# Altium schematic sheet CCD.SchDoc
size A4; SheetNumber: 4; SheetTotal: 5
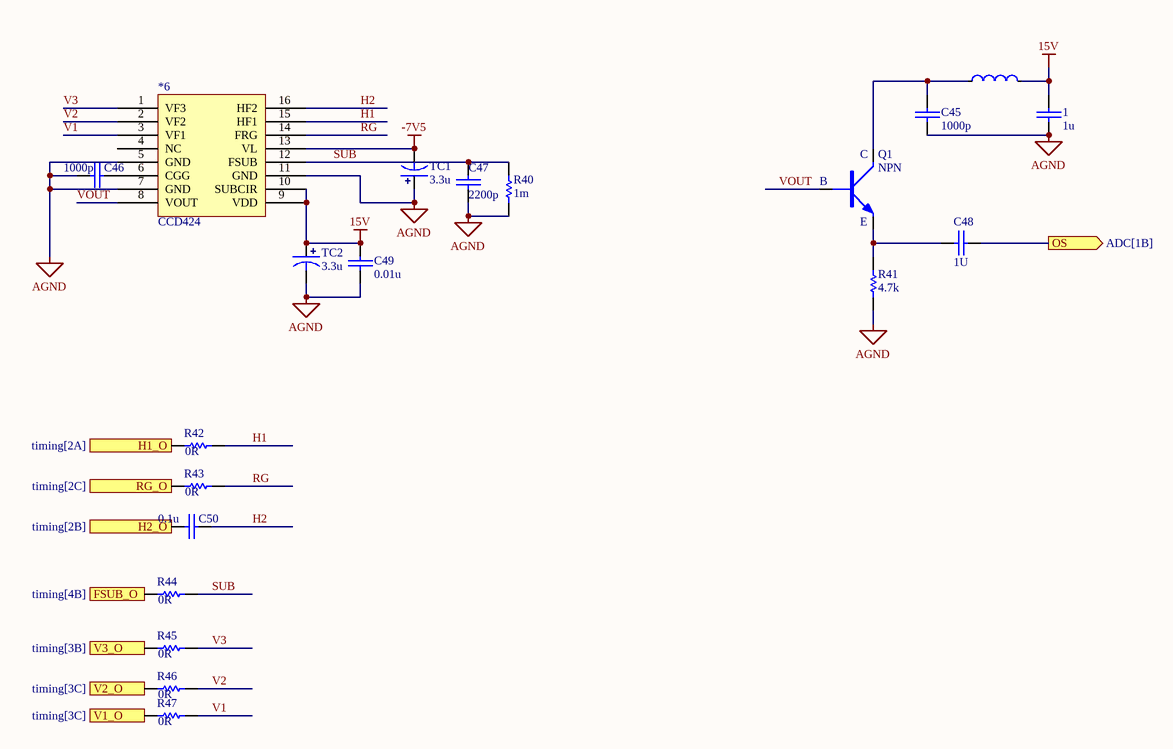
[diagram p0: CCD.SchDoc]

## Parts
1  1u  [0603C]
*6  CCD424  [CCD424]
C45  1000p  [0603C]
C46  1000p  [0603C]
C47  2200p  [0603C]
C48  1U  [0603C]
C49  0.01u  [0603C]
C50  0.1u  [0603C]
L13  GZ1608D601TF  [0603L]  (value not drawn)
Q1  NPN  [SOT23-3]
R40  1m  [0603R]
R41  4.7k  [0603R]
R42  0R  [0603R]
R43  0R  [0603R]
R44  0R  [0603R]
R45  0R  [0603R]
R46  0R  [0603R]
R47  0R  [0603R]
TC1  3.3u  [TAJ-A/3216]
TC2  3.3u  [TAJ-A/3216]

## Ports
FSUB_O (in, see timing[4B]), H1_O (in, see timing[2A]), H2_O (in, see timing[2B]), OS (out, see ADC[1B]), RG_O (in, see timing[2C]), V1_O (in, see timing[3C]), V2_O (in, see timing[3C]), V3_O (in, see timing[3B])

## Nets
15V: 1.2 *6.9(VDD) *6.10(SUBCIR) C49.2 L13.2 TC2.1
-7V5: *6.13(VL) TC1.2
AGND: 1.1 *6.5(GND) *6.7(GND) *6.11(GND) C45.1 C46.2 C47.1 C49.1 R40.1 R41.1 TC1.1 TC2.2
FSUB_O: R44.2 ; port FSUB_O
H1: *6.15(HF1) R42.1
H1_O: R42.2 ; port H1_O
H2: *6.16(HF2) C50.1
H2_O: C50.2 ; port H2_O
OS: C48.1 ; port OS
RG: *6.14(FRG) R43.1
RG_O: R43.2 ; port RG_O
SUB: *6.12(FSUB) C47.2 R40.2 R44.1
V1: *6.3(VF1) R47.1
V1_O: R47.2 ; port V1_O
V2: *6.2(VF2) R46.1
V2_O: R46.2 ; port V2_O
V3: *6.1(VF3) R45.1
V3_O: R45.2 ; port V3_O
VOUT: *6.8(VOUT) Q1.1(B)
Net*6_6: *6.6(CGG) C46.1
NetC45_2: C45.2 L13.1 Q1.3(C)
NetC48_2: C48.2 Q1.2(E) R41.2

Not connected (* = marked no-connect by the designer): *6 4(NC)

## Library data of the parts
1 C45-C50 = CAP: 无极性电容
L13 = FB: 铁氧体磁珠; Manufacturer: Sunlord(顺络); Add into BOM: yes; Impedance @ Frequency: 600Ω@100MHz; Tolerance: ±25%; DC Resistance: 450mΩ; Current Rating: 200mA; Circuits: 1; Name: GZ1608D601TF; Symbol: GZ1608D601TF; Device: GZ1608D601TF; LCSC Part Name: 600Ω@100MHz ±25%; Supplier Part: C1002; Manufacturer Part: GZ1608D601TF; Supplier Footprint: 0603; JLCPCB Part Class: Basic Part; Datasheet: https://atta.szlcsc.com/upload/public/pdf/source/20210830/355EA7C0FAC5394FC0FE3F17C770C20A.pdf; Supplier: LCSC; Convert to PCB: yes
Q1 = NPN: NPN三极管
R40-R47 = RES: 电阻
TC1 TC2 = TCAP: 钽电容